# Altium schematic sheet Motor.SchDoc
size A4; PageSetup: Record=PageOptions|CenterHorizontal=True|CenterVertical=True|PrintScale=0.97|XCorrection=1.00|YCorrection=1.00|PrintKind=0|BorderSize=5000000|LeftOffset=0|BottomOffset=0|Orientation=2|PaperLength=1000|PaperWidth=1000|Scale=100|PaperSource=7|PrintQuality=-4|MediaType=1|DitherType=10|PaperKind=A4|PrintScaleMode=1
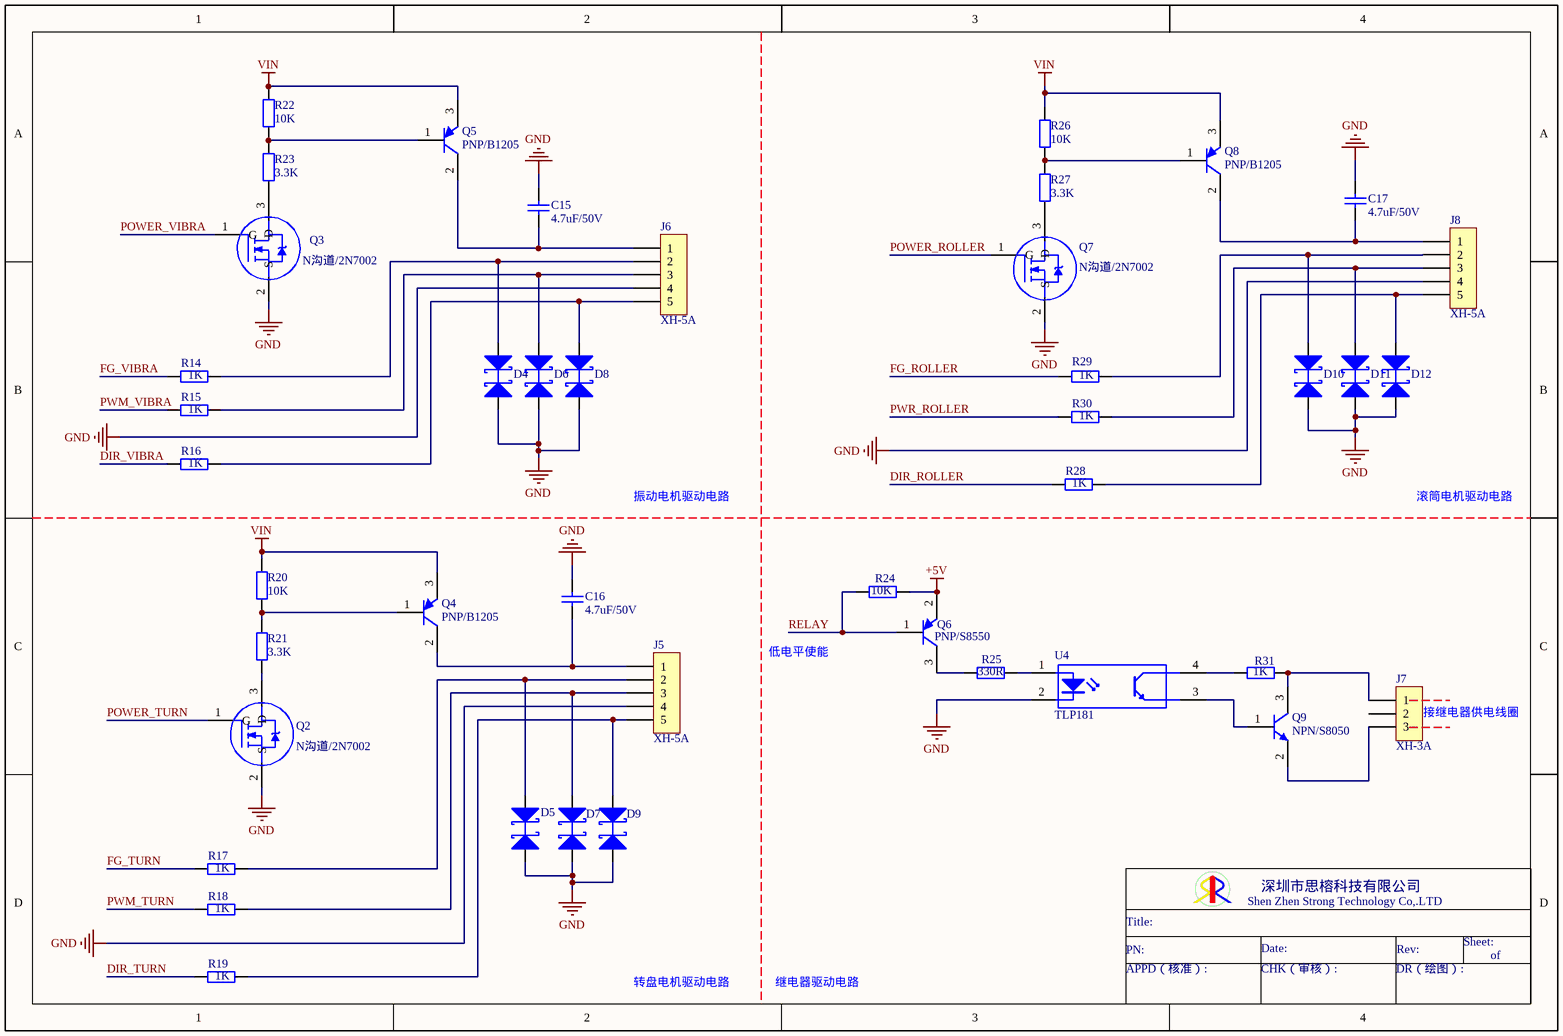
[diagram p0: Motor.SchDoc]

## Parts
C15  4.7uF/50V  [0603C]
C16  4.7uF/50V  [0603C]
C17  4.7uF/50V  [0603C]
D4  ESD5B5.0ST1G  [SOD-523]  (value not drawn)
D5  ESD5B5.0ST1G  [SOD-523]  (value not drawn)
D6  ESD5B5.0ST1G  [SOD-523]  (value not drawn)
D7  ESD5B5.0ST1G  [SOD-523]  (value not drawn)
D8  ESD5B5.0ST1G  [SOD-523]  (value not drawn)
D9  ESD5B5.0ST1G  [SOD-523]  (value not drawn)
D10  ESD5B5.0ST1G  [SOD-523]  (value not drawn)
D11  ESD5B5.0ST1G  [SOD-523]  (value not drawn)
D12  ESD5B5.0ST1G  [SOD-523]  (value not drawn)
J5  XH-5A  [CN5-2.54]
J6  XH-5A  [CN5-2.54]
J7  XH-3A  [CN3-2.54]
J8  XH-5A  [CN5-2.54]
Q2  N沟道/2N7002  [SOT-23]
Q3  N沟道/2N7002  [SOT-23]
Q4  PNP/B1205  [TO-252]
Q5  PNP/B1205  [TO-252]
Q6  PNP/S8550  [SOT-23]
Q7  N沟道/2N7002  [SOT-23]
Q8  PNP/B1205  [TO-252]
Q9  NPN/S8050  [TO-92MOD]
R14  1K  [0603R]
R15  1K  [0603R]
R16  1K  [0603R]
R17  1K  [0603R]
R18  1K  [0603R]
R19  1K  [0603R]
R20  10K  [0603R]
R21  3.3K  [0805R]
R22  10K  [0603R]
R23  3.3K  [0805R]
R24  10K  [0603R]
R25  330R  [0603R]
R26  10K  [0603R]
R27  3.3K  [0805R]
R28  1K  [0603R]
R29  1K  [0603R]
R30  1K  [0603R]
R31  1K  [0603R]
U4  TLP181  [SOP4-2.54]

## Nets
+5V: Q6.2(E) R24.1
GND: C15.2 C16.2 C17.2 D4.2 D5.2 D6.2 D7.2 D8.2 D9.2 D10.2 D11.2 D12.2 J5.4 J6.4 J8.4 Q2.2(S) Q3.2(S) Q7.2(S) U4.2(K)
VIN: Q4.3(E) Q5.3(E) Q8.3(E) R20.1 R22.2 R26.1
DIR_ROLLER: R28.1
DIR_TURN: R19.1
DIR_VIBRA: R16.1
FG_ROLLER: R29.1
FG_TURN: R17.1
FG_VIBRA: R14.1
POWER_ROLLER: Q7.1(G)
POWER_TURN: Q2.1(G)
POWER_VIBRA: Q3.1(G)
PWM_TURN: R18.1
PWM_VIBRA: R15.1
PWR_ROLLER: R30.1
RELAY: Q6.1(B) R24.2
NetC15_1: C15.1 J6.1 Q5.2(C)
NetC16_1: C16.1 J5.1 Q4.2(C)
NetC17_1: C17.1 J8.1 Q8.2(C)
NetD4_1: D4.1 J6.2 R14.2
NetD5_1: D5.1 J5.2 R17.2
NetD6_1: D6.1 J6.3 R15.2
NetD7_1: D7.1 J5.3 R18.2
NetD8_1: D8.1 J6.5 R16.2
NetD9_1: D9.1 J5.5 R19.2
NetD10_1: D10.1 J8.2 R29.2
NetD11_1: D11.1 J8.3 R30.2
NetD12_1: D12.1 J8.5 R28.2
NetJ7_1: J7.1 Q9.3(C) R31.2
NetJ7_3: J7.3 Q9.2(E)
NetQ2_3: Q2.3(D) R21.1
NetQ3_3: Q3.3(D) R23.1
NetQ4_1: Q4.1(B) R20.2 R21.2
NetQ5_1: Q5.1(B) R22.1 R23.2
NetQ6_3: Q6.3(C) R25.1
NetQ7_3: Q7.3(D) R27.1
NetQ8_1: Q8.1(B) R26.2 R27.2
NetQ9_1: Q9.1(B) U4.3(E)
NetR25_2: R25.2 U4.1(A)
NetR31_1: R31.1 U4.4(C)

Not connected (* = marked no-connect by the designer): J7 2

## Notes on the sheet
- 振动电机驱动电路
- 滚筒电机驱动电路
- 低电平使能
- (near J7) 接继电器供电线圈
- 转盘电机驱动电路
- 继电器驱动电路
- Shen Zhen Strong Technology Co,.LTD
- 深圳市思榕科技有限公司
- Title:
- PN:
- APPD（核准）:
- Date:
- CHK（审核）:
- DR（绘图）:
- Rev:
- Sheet:
- of

## Library data of the parts
C15-C17 = C4.7uF-0603: 瓷片电容,4.7uF,5%,X7R,50V,0603; 料号: 10201-47042-00; 品名: 瓷片电容
D4-D12 = ESD5B5.0ST1G: TVS管,5V,SOD-523; 料号: 10405-00037-00; 品名: TVS管
J5 J6 J8 = CONN-XH-5A: CONN,XH-5A,5PIN,2.54mm插座; 料号: 10701-00010-00; 品名: 线对板连接器
J7 = CONN-XH-3A: CONN,XH-3A,3PIN,2.54mm插座; 料号: 10701-00004-00; 品名: 线对板连接器
Q2 Q3 Q7 = 2N7002: N沟道场效应管，2N7002，SOT-23; 料号: 10503-00003-1H; 品名: N沟道场效应管
Q4 Q5 Q8 = B1205: PNP型三极管，B1205，SOT－23; 品名: PNP型三极管
Q6 = S8550: PNP型三极管，S8550，SOT－23; 料号: 10502-00001-00; 品名: PNP型三极管
Q9 = S8050: NPN型三极管，S8050，SOT－23; 料号: 10501-00001-00; 品名: NPN型三极管
R14-R19 R28-R31 = R1K-0603: 金属膜电阻,1K,1%,1/10W,0603; 料号: 10101-10012-00; 品名: 金属膜电阻
R20 R22 R24 R26 = R10K-0603: 金属膜电阻,10K,1%,1/10W,0603; 料号: 10101-10022-00; 品名: 金属膜电阻
R21 R23 R27 = R3.3K-0603: 金属膜电阻,3.3K,1%,1/10W,0603; 料号: 10101-33012-00; 品名: 金属膜电阻
R25 = R33R-0805: 金属膜电阻,330R,1%,1/10W,0603; 料号: 10101-03303-00; 品名: 金属膜电阻
U4 = TLP181: 光耦，TLP181，SOP4; 料号: 10609-00009-9J; 品名: 光耦